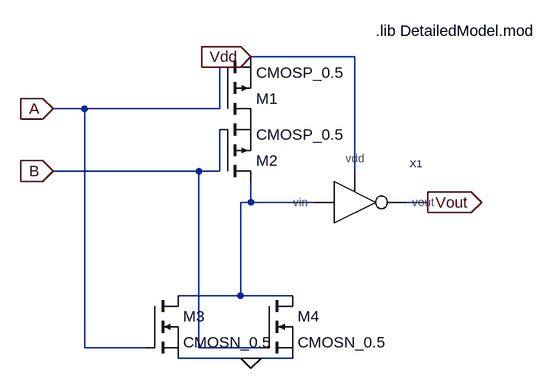
[diagram p0: schematic s_or.asc]
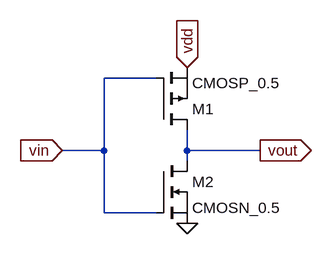
[diagram p1: sub-circuit s_inv.asc]
s_or.asc, the LTspice schematic file:
Version 4
SHEET 1 880 680
WIRE 336 64 176 64
WIRE -80 144 -128 144
WIRE 128 144 128 80
WIRE 128 144 -80 144
WIRE 96 240 -128 240
WIRE 128 240 128 176
WIRE 128 240 96 240
WIRE 336 240 336 64
WIRE 176 288 176 256
WIRE 176 288 160 288
WIRE 272 288 176 288
WIRE 448 288 416 288
WIRE 160 432 160 288
WIRE 160 432 64 432
WIRE 240 432 160 432
WIRE -80 512 -80 144
WIRE 16 512 -80 512
WIRE 96 512 96 240
WIRE 192 512 96 512
WIRE 176 528 64 528
WIRE 240 528 176 528
FLAG 176 528 0
FLAG -128 144 A
IOPIN -128 144 In
FLAG -128 240 B
IOPIN -128 240 In
FLAG 176 64 Vdd
IOPIN 176 64 In
FLAG 448 288 Vout
IOPIN 448 288 Out
SYMBOL pmos 128 160 M180
SYMATTR InstName M1
SYMATTR Value CMOSP_0.5
SYMBOL pmos 128 256 M180
SYMATTR InstName M2
SYMATTR Value CMOSP_0.5
SYMBOL nmos 16 432 R0
SYMATTR InstName M3
SYMATTR Value CMOSN_0.5
SYMBOL nmos 192 432 R0
SYMATTR InstName M4
SYMATTR Value CMOSN_0.5
SYMBOL s_inv 336 288 R0
SYMATTR InstName X1
TEXT 368 24 Left 2 !.lib DetailedModel.mod

s_inv.asc, the sub-circuit schematic file:
Version 4
SHEET 1 880 680
WIRE 128 -112 48 -112
WIRE 48 0 48 -112
WIRE 48 0 -16 0
WIRE 176 0 176 -32
WIRE 288 0 176 0
WIRE 176 16 176 0
WIRE 48 96 48 0
WIRE 128 96 48 96
FLAG 288 0 vout
IOPIN 288 0 Out
FLAG -16 0 vin
IOPIN -16 0 In
FLAG 176 -128 vdd
IOPIN 176 -128 In
FLAG 176 112 0
SYMBOL pmos 128 -32 M180
SYMATTR InstName M1
SYMATTR Value CMOSP_0.5
SYMBOL nmos 128 16 R0
SYMATTR InstName M2
SYMATTR Value CMOSN_0.5

The netlist it stands for:
* s_or.asc
M1 P001 A Vdd Vdd CMOSP_0.5
M2 N001 B P001 P001 CMOSP_0.5
M3 N001 A 0 0 CMOSN_0.5
M4 N001 B 0 0 CMOSN_0.5
XX1 N001 Vout Vdd s_inv

* block symbol definitions
.subckt s_inv vin vout vdd
M1 vout vin vdd vdd CMOSP_0.5
M2 vout vin 0 0 CMOSN_0.5
.ends s_inv

.model NMOS NMOS
.model PMOS PMOS
.lib standard.mos
.lib DetailedModel.mod
.backanno
.end